# Altium schematic sheet NADP.SchDoc: Adaptador Nutaq
size A4; Author: RCP; DrawnBy: RCP; Engineer: RCP
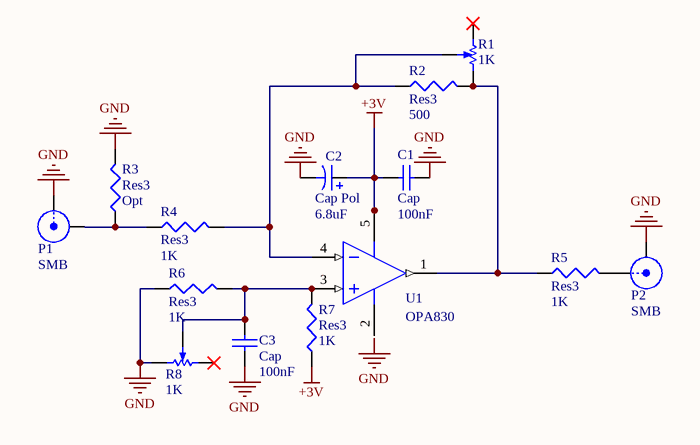
[diagram p0: NADP.SchDoc]

## Parts
C1  Cap  value 100nF  [1608[0603]]
C2  Cap Pol  value 6.8uF  [1608[0603]]
C3  Cap  value 100nF  [1608[0603]]
P1  SMB  [SMB_V-RJ45]
P2  SMB  [SMB_V-RJ45]
R1  1K  [POT4MM-2]
R2  Res3  value 500  [J1-0603]
R3  Res3  value Opt  [J1-0603]
R4  Res3  value 1K  [J1-0603]
R5  Res3  value 1K  [J1-0603]
R6  Res3  value 1K  [J1-0603]
R7  Res3  value 1K  [J1-0603]
R8  1K  [POT4MM-2]
U1  OPA830  [SOT23-5_N]

## Nets
+3V: C1.1 C2.1 R7.1 U1.5(VCC)
GND: C1.2 C2.2 C3.2 P1.1(X) P2.2(Y) R3.2 R6.1 R8.CW(+)
NetC3_1: C3.1 R6.2 R7.2 R8.W U1.3(IN+)
NetP1_2: P1.2(Y) R3.1 R4.1
NetP2_1: P2.1(X) R5.2
NetR1_CW: R1.CW(+) R2.2 R5.1 U1.1(OUT)
NetR1_W: R1.W R2.1 R4.2 U1.4(IN-)

Not connected (* = marked no-connect by the designer): R1 CCW(-)*; R8 CCW(-)*; U1 2(VEE)

## Notes on the sheet
- Labels drawn without touching a wire or pin: GND

## Library data of the parts
C1 C3 = Cap Semi: Capacitor (Semiconductor SIM Model); Published: 8-Jun-2000; LatestRevisionDate: 29-May-2009; LatestRevisionNote: IPC-7351 Footprint Added.; PackageReference: C1206; Publisher: Altium Limited; PackageDescription: Chip Capacitor
C2 = Cap Pol3: Polarized Capacitor (Surface Mount); Published: 8-Jun-2000; LatestRevisionDate: 29-May-2009; LatestRevisionNote: IPC-7351 Footprint Added.; PackageReference: C0805; Publisher: Altium Limited; PackageDescription: Chip Capacitor
P1 P2 = SMB: SMB Straight Connector; LatestRevisionDate: 17-Jul-2002; LatestRevisionNote: Re-released for DXP Platform.; Publisher: Altium Limited
R1 R8 = RPot SM: Square Trimming Potentiometer; Published: 17-Dec-2003; DatasheetVersion: Oct-2003; PackageReference: POT4MM-2; Publisher: Altium Limited; PackageDescription: Square Trimming Potentiometer; ComponentLink1Description: Manufacturer Link; ComponentLink1URL: http://bourns.com/2/search.html
R2-R7 = Res3: Resistor; Published: 8-Jun-2000; LatestRevisionDate: 29-May-2009; LatestRevisionNote: IPC-7351 Footprint Added.; PackageReference: J1-0603; Publisher: Altium Limited; PackageDescription: Chip Resistor
U1 = MAX477EUK-T: 300MHZ High-Speed Op Amp; Published: 23-Sep-2002; LatestRevisionDate: 29-May-2009; LatestRevisionNote: IPC-7351 Footprint Added.; DatasheetVersion: Rev 2; 5/97; PackageVersion: revE, 2004; PackageReference: SOT23-5; Publisher: Altium Limited; PackageDescription: 5-Pin SOT-23 Package 0.95 mm Pitch, 2.8 mm Lead Span; Code_JEITA: SC-74A; Code_IPC: SOT23-5; ComponentLink1Description: Manufacturer Link; ComponentLink1URL: http://www.maxim-ic.com/; ComponentLink2Description: Datasheet; ComponentLink2URL: http://pdfserv.maxim-ic.com/en/ds/MAX477.pdf